# Altium project 16-07349-R5_SAM_L10_XPro.PrjPcb (part 2 of 3)

## Sheet SHT_4_MCU_07349-R5_L10.SchDoc
size B; CompanyName: Microchip Technology Inc.; Organization: Microchip Technology; Address1: 2355 West Chandler Blvd.; Address2: Chandler, AZ  85224; Address4: USA; SheetNumber: 4; SheetTotal: 9; SheetTitle: Target MCU; Time: Time
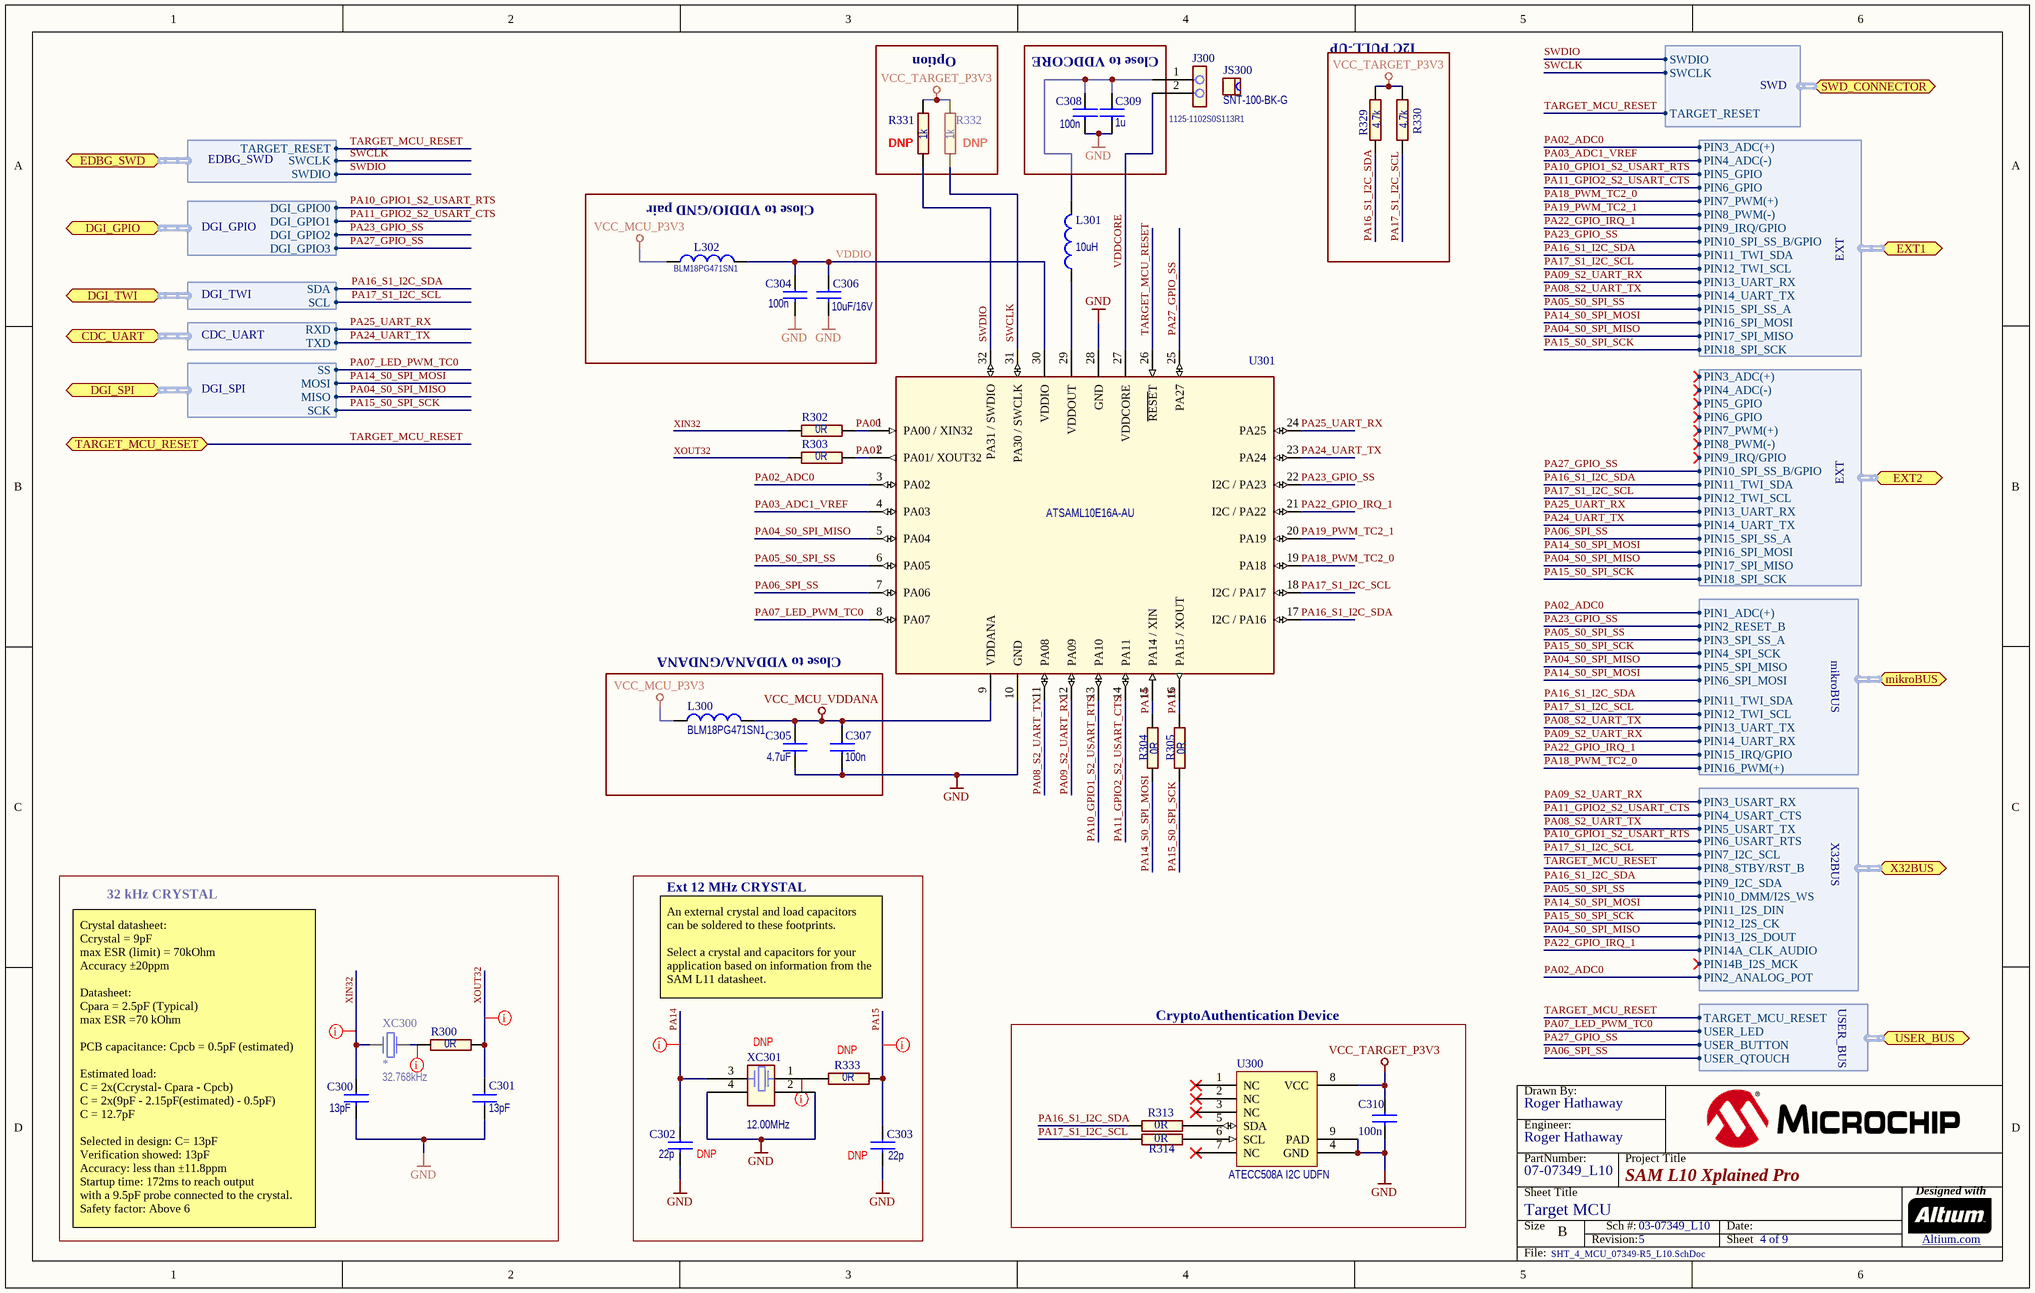
[diagram p5: SHT_4_MCU_07349-R5_L10.SchDoc]

### Parts
(Parts that share a designator on the sheet are numbered #1, #2 ... from top to bottom, then left to right.)
?#6  (no value)  (graphical)
C300  value 13pF  [AP1-00053]  (hidden comment: CAP-NONPOL)
C301  value 13pF  [AP1-00053]  (hidden comment: CAP-NONPOL)
C302  value 22p  Placement: DNP  [AP1-00001]  (hidden comment: CAP-NONPOL)
C303  value 22p  Placement: DNP  [AP1-00001]  (hidden comment: CAP-NONPOL)
C304  value 100n  [AP1-00001]  (hidden comment: CAP-NONPOL)
C305  value 4.7uF  [AP1-00039]  (hidden comment: CAP-NONPOL)
C306  value 10uF/16V  [AP1-00039]  (hidden comment: CAP-NONPOL)
C307  value 100n  [AP1-00001]  (hidden comment: CAP-NONPOL)
C308  value 100n  [AP1-00001]  (hidden comment: CAP-NONPOL)
C309  value 1u  [AP1-00001]  (hidden comment: CAP-NONPOL)
C310  value 100n  [AP1-00053]
J300  MPN: 1125-1102S0S113R1  [AP8-01074]  (hidden comment: HEADER 1x2)
JS300  value SNT-100-BK-G  [AP8-00525]  (hidden comment: To be used by request from ESCATEC)
L300  value BLM18PG471SN1  [AP3-00005]  (hidden comment: INDUCTOR)
L301  value 10uH  [AP3-00157]  (hidden comment: INDUCTOR)
L302  value BLM18PG471SN1  [AP3-00005]  (hidden comment: INDUCTOR)
R300  value 0R  [AP2-00000]
R302  value 0R  [AP2-00000]
R303  value 0R  [AP2-00000]
R304  value 0R  [AP2-00000]
R305  value 0R  [AP2-00000]
R313  value 0R  [AP2-00000]
R314  value 0R  [AP2-00000]
R329  value 4.7k  [AP2-00032]
R330  value 4.7k  [AP2-00032]
R331  value 1k  Placement: DNP  [AP2-00000]
R332  value 1k  Placement: DNP  [AP2-00000]
R333  value 0R  Placement: DNP  [AP2-00000]
U300  value ATECC508A I2C UDFN  [AP6-00409]
U301  ATSAML10E16A-AU  [AP6-00508]
XC300  *  value 32.768kHz  [AP7-00090]
XC301  value 12.00MHz  Placement: DNP  [AP7-00039]

### Blocks framed on the sheet
Option: R331 R332
Close to VDDCORE: C308 C309
I2C PULL-UP: R329 R330
Close to VDDIO/GND pair: C304 C306 L302
32 kHz CRYSTAL: C300 C301 R300 XC300
Ext 12 MHz CRYSTAL: C302 C303 R333 XC301
CryptoAuthentication Device: C310 R313 R314 U300

### Ports
CDC_UART (harness CDC_UART), DGI_GPIO (harness DGI_GPIO), DGI_SPI (harness DGI_SPI), DGI_TWI (harness DGI_TWI), EDBG_SWD (harness EDBG_SWD), EXT1 (harness EXT), EXT2 (harness EXT), mikroBUS (harness mikroBUS), SWD_CONNECTOR (harness SWD), TARGET_MCU_RESET (bidir), USER_BUS (harness USER_BUS), X32BUS (harness X32BUS)

### Harnesses
DGI_GPIO: DGI_GPIO0, DGI_GPIO1, DGI_GPIO2, DGI_GPIO3
DGI_SPI: MISO, MOSI, SCK, SS
DGI_TWI: SCL, SDA
CDC_UART: RXD, TXD
EXT: PIN10_SPI_SS_B/GPIO, PIN11_TWI_SDA, PIN12_TWI_SCL, PIN13_UART_RX, PIN14_UART_TX, PIN15_SPI_SS_A, PIN16_SPI_MOSI, PIN17_SPI_MISO, PIN18_SPI_SCK, PIN3_ADC(+), PIN4_ADC(-), PIN5_GPIO, PIN6_GPIO, PIN7_PWM(+), PIN8_PWM(-), PIN9_IRQ/GPIO
SWD: SWCLK, SWDIO, TARGET_RESET
EDBG_SWD: TARGET_RESET, SWCLK, SWDIO
mikroBUS: PIN1_ADC(+), PIN2_RESET_B, PIN3_SPI_SS_A, PIN4_SPI_SCK, PIN5_SPI_MISO, PIN6_SPI_MOSI, PIN11_TWI_SDA, PIN12_TWI_SCL, PIN13_UART_TX, PIN14_UART_RX, PIN15_IRQ/GPIO, PIN16_PWM(+)
X32BUS: PIN13_I2S_DOUT, PIN11_I2S_DIN, PIN9_I2C_SDA, PIN7_I2C_SCL, PIN5_USART_TX, PIN3_USART_RX, PIN4_USART_CTS, PIN6_USART_RTS, PIN8_STBY/RST_B, PIN10_DMM/I2S_WS, PIN12_I2S_CK, PIN14A_CLK_AUDIO, PIN14B_I2S_MCK, PIN2_ANALOG_POT
USER_BUS: USER_QTOUCH, USER_BUTTON, USER_LED, TARGET_MCU_RESET

### Nets
GND: C300.2 C301.2 C302.2 C303.2 C304.2 C305.2 C306.2 C307.2 C308.2 C309.2 C310.2 U300.4(GND) U300.9(PAD) U301.10(GND) U301.28(GND) XC301.2 XC301.4
VCC_MCU_P3V3: L300.1 L302.2
VCC_MCU_VDDANA: C305.1 C307.1 L300.2 U301.9(VDDANA)
VCC_TARGET_P3V3: C310.1 R329.1 R330.1 R331.1 R332.1 U300.8(VCC)
PA00: R302.2 U301.1(PA00_/_XIN32)
PA01: R303.2 U301.2(PA01/_XOUT32)
PA02_ADC0: U301.3(PA02) ; port EXT1.PIN3_ADC(+), port mikroBUS.PIN1_ADC(+), port X32BUS.PIN2_ANALOG_POT
PA03_ADC1_VREF: U301.4(PA03) ; port EXT1.PIN4_ADC(-)
PA04_S0_SPI_MISO: U301.5(PA04) ; port DGI_SPI.MISO, port EXT1.PIN17_SPI_MISO, port EXT2.PIN17_SPI_MISO, port mikroBUS.PIN5_SPI_MISO, port X32BUS.PIN13_I2S_DOUT
PA05_S0_SPI_SS: U301.6(PA05) ; port EXT1.PIN15_SPI_SS_A, port mikroBUS.PIN3_SPI_SS_A, port X32BUS.PIN10_DMM/I2S_WS
PA06_SPI_SS: U301.7(PA06) ; port EXT2.PIN15_SPI_SS_A, port USER_BUS.USER_QTOUCH
PA07_LED_PWM_TC0: U301.8(PA07) ; port DGI_SPI.SS, port USER_BUS.USER_LED
PA08_S2_UART_TX: U301.11(PA08) ; port EXT1.PIN14_UART_TX, port mikroBUS.PIN13_UART_TX, port X32BUS.PIN5_USART_TX
PA09_S2_UART_RX: U301.12(PA09) ; port EXT1.PIN13_UART_RX, port mikroBUS.PIN14_UART_RX, port X32BUS.PIN3_USART_RX
PA10_GPIO1_S2_USART_RTS: U301.13(PA10) ; port DGI_GPIO.DGI_GPIO0, port EXT1.PIN5_GPIO, port X32BUS.PIN6_USART_RTS
PA11_GPIO2_S2_USART_CTS: U301.14(PA11) ; port DGI_GPIO.DGI_GPIO1, port EXT1.PIN6_GPIO, port X32BUS.PIN4_USART_CTS
PA14: C302.1 R304.2 U301.15(PA14_/_XIN) XC301.3
PA14_S0_SPI_MOSI: R304.1 ; port DGI_SPI.MOSI, port EXT1.PIN16_SPI_MOSI, port EXT2.PIN16_SPI_MOSI, port mikroBUS.PIN6_SPI_MOSI, port X32BUS.PIN11_I2S_DIN
PA15: C303.1 R305.2 R333.1 U301.16(PA15_/_XOUT)
PA15_S0_SPI_SCK: R305.1 ; port DGI_SPI.SCK, port EXT1.PIN18_SPI_SCK, port EXT2.PIN18_SPI_SCK, port mikroBUS.PIN4_SPI_SCK, port X32BUS.PIN12_I2S_CK
PA16_S1_I2C_SDA: R313.2 R329.2 U301.17(I2C_/_PA16) ; port DGI_TWI.SDA, port EXT1.PIN11_TWI_SDA, port EXT2.PIN11_TWI_SDA, port mikroBUS.PIN11_TWI_SDA, port X32BUS.PIN9_I2C_SDA
PA17_S1_I2C_SCL: R314.2 R330.2 U301.18(I2C_/_PA17) ; port DGI_TWI.SCL, port EXT1.PIN12_TWI_SCL, port EXT2.PIN12_TWI_SCL, port mikroBUS.PIN12_TWI_SCL, port X32BUS.PIN7_I2C_SCL
PA18_PWM_TC2_0: U301.19(PA18) ; port EXT1.PIN7_PWM(+), port mikroBUS.PIN16_PWM(+)
PA19_PWM_TC2_1: U301.20(PA19) ; port EXT1.PIN8_PWM(-)
PA22_GPIO_IRQ_1: U301.21(I2C_/_PA22) ; port EXT1.PIN9_IRQ/GPIO, port mikroBUS.PIN15_IRQ/GPIO, port X32BUS.PIN14A_CLK_AUDIO
PA23_GPIO_SS: U301.22(I2C_/_PA23) ; port DGI_GPIO.DGI_GPIO2, port EXT1.PIN10_SPI_SS_B/GPIO, port mikroBUS.PIN2_RESET_B
PA24_UART_TX: U301.23(PA24) ; port CDC_UART.TXD, port EXT2.PIN14_UART_TX
PA25_UART_RX: U301.24(PA25) ; port CDC_UART.RXD, port EXT2.PIN13_UART_RX
PA27_GPIO_SS: U301.25(PA27) ; port DGI_GPIO.DGI_GPIO3, port EXT2.PIN10_SPI_SS_B/GPIO, port USER_BUS.USER_BUTTON
SWCLK: R332.2 U301.31(PA30_/_SWCLK) ; port SWD_CONNECTOR.SWCLK, port EDBG_SWD.SWCLK
SWDIO: R331.2 U301.32(PA31_/_SWDIO) ; port SWD_CONNECTOR.SWDIO, port EDBG_SWD.SWDIO
TARGET_MCU_RESET: U301.26(~{RESE}T) ; port TARGET_MCU_RESET, port SWD_CONNECTOR.TARGET_RESET, port EDBG_SWD.TARGET_RESET, port X32BUS.PIN8_STBY/RST_B, port USER_BUS.TARGET_MCU_RESET
VDDCORE: J300.2 U301.27(VDDCORE)
VDDIO: C304.1 C306.1 L302.1 U301.30(VDDIO)
XIN32: C300.1 R302.1 XC300.2
XOUT32: C301.1 R300.2 R303.1
NetC308_1: C308.1 C309.1 J300.1 L301.1
NetL301_2: L301.2 U301.29(VDDOUT)
NetR300_1: R300.1 XC300.1
NetR313_1: R313.1 U300.5(SDA)
NetR314_1: R314.1 U300.6(SCL)
NetR333_2: R333.2 XC301.1

Not connected (* = marked no-connect by the designer): U300 1(NC)* 2(NC)* 3(NC)* 7(NC)*

### Layout directives
rule Assembly Testpoint Usage [Testpoint - Not Allowed    Multiple - Not Allowed]: (no net found under the mark), NetR300_1, PA14, PA15, XIN32, XOUT32

### Notes on the sheet
- Close to VDDANA/GNDANA
- An external crystal and load capacitors can be soldered to these footprints.
  Select a crystal and capacitors for your application based on information from the SAM L11 datasheet.
- (near C300) Crystal datasheet:
  Ccrystal = 9pF
  max ESR (limit) = 70kOhm
  Accuracy ±20ppm
  Datasheet:
  Cpara = 2.5pF (Typical)
  max ESR =70 kOhm
  PCB capacitance: Cpcb = 0.5pF (estimated)
  Estimated load:
  C = 2x(Ccrystal- Cpara - Cpcb)
  C = 2x(9pF - 2.15pF(estimated) - 0.5pF)
  C = 12.7pF
  Selected in design: C= 13pF
  Verification showed: 13pF
  Accuracy: less than ±11.8ppm
  Startup time: 172ms to reach output
  with a 9.5pF probe connected to the crystal.
  Safety factor: Above 6
- Drawn By:
- Engineer:
- PartNumber:
- Project Title
- Sheet Title
- Size
- B
- Revision:
- Sch #:
- Date:
- Sheet
- Designed with
- Altium.com <http://go.altium.com/MicrochipLandingPage_Evaluation.html>
- File:

### Library data of the parts
?#6 = Title Block B
C300 C301 = A01-0793: Ceramic capacitor, SMD 0402, NP0, 50V, +/-5%; PartGroup: Capacitors,Ceramic,SMD 0402; Manufacturer: Murata; MPN: GRM1555C1H130JA01D; Tolerance: 5%; TemperatureRange: -55 - +125 deg C; ComponentStatus: 'Active (verified)'; Status: Active; Verified by: Lars Helge Mo; Verified date: 2005-12-15; AN: A01-0793; FootprintStatus: 'Active (Verified)'
C302 C303 = A01-0019: Ceramic capacitor, SMD 0402, NP0, 50V, +/-5%; PartGroup: Capacitors,Ceramic,SMD 0402; Manufacturer: YAGEO CORP; MPN: CC0402JRNPO9BN220; TemperatureRange: -55 - +125 deg C; ComponentStatus: 'Active (verified)'; Status: Active; Verified by: Lars Helge Mo; Verified date: 2005-12-15; AN: A01-0019; Tolerance: 50V, +/-5%; Height: 0.550000011920929; FootprintStatus: 'Active (Verified)'
C304 C307 C308 C310 = A01-0246: as C501 on sheet SHT_6_I_Measure_07349-R5_L10; Status: Active; Verified by: Lars Helge Mo; Verified date: 2005-12-15; AN: A01-0246; Tolerance: 16V, +/-10%; Height: 0.5; FootprintStatus: 'Active (Verified)'
C305 = A01-0377: Ceramic capacitor, SMD 0603, X5R, 10V, 10% (de31036); PartGroup: Capacitors,Ceramic,SMD 0603; Manufacturer: WALSIN Technology Corporation; MPN: 0603X475K100CT; TemperatureRange: -55 - +85 deg C; ComponentStatus: 'Active (verified)'; Status: Active; Verified by: Lars Helge Mo; Verified date: 2005-12-15; AN: A01-0377; Tolerance: 10%; Height: 0.800000011920929; FootprintStatus: 'Active (Verified)'
C306 = A01-0491: Ceramic capacitor, SMD 0603, X5R, 16V, 10UF ± 20% (High Density); PartGroup: Capacitors,Ceramic,SMD 0603; Manufacturer: Taiyo Yuden; MPN: EMK107BBJ106MA-T; Tolerance: ­± 20%; TemperatureRange: -55°C to +85°C; ComponentStatus: 'Active (verified)'; Status: Active; Verified by: Lars Helge Mo; Verified date: 2005-12-15; AN: A01-0491; Height: 0.819999992847443; FootprintStatus: 'Active (Verified)'
C309 = A01-0286: Ceramic capacitor, SMD 0402, X5R, 6.3V, +/-10% (de26942); PartGroup: Capacitors,Ceramic,SMD 0402; Manufacturer: Kemet; MPN: C0402C105K9PAC; TemperatureRange: -55 to 85 deg C; ComponentStatus: 'Active (verified)'; Status: Active; Verified by: Lars Helge Mo; Verified date: 2005-12-15; AN: A01-0286; Tolerance: +/-10%; Height: 0.5; FootprintStatus: 'Active (Verified)'
J300 = A08-2782: 1x2 pin header, 2.54mm pitch, Pin-in-Paste THM; PartGroup: Mechanical devices,Connectors,Pin headers; Manufacturer: WCON HARDWARE ELECTRONICS CO., LTD; Value: 1125-1102S0S113R1; TemperatureRange: -40Â°C to +105Â°C; ComponentStatus: 'Active (verified)'; Verified date: 2006-01-30; Verified by: Lars Helge; Status: Active; AN: A08-2782; Height: 9; FootprintStatus: 'Active (Verified)'
JS300 = A08-0543: Jumper cap for 2.54mm pinheader; PartGroup: Mechanical devices,Mounting accessories,Other; Manufacturer: SAMTEC; ComponentStatus: 'Active (verified)'; Verified date: 2006-04-05; Verified by: Lars Helge Mo; Status: Active; AN: A08-0543; MPN: SNT-100-BK-G; FootprintStatus: 'Active (Verified)'
L300 L302 = A03-0035: SMD RF inductor 0603. Z=470Ohm (@100MHz), Max R(dc)=0.20Ohm, Max current=1A; PartGroup: Inductors,EMI; Manufacturer: Murata; TemperatureRange: -55; ComponentStatus: 'Active (verified)'; Verified date: 2006-01-30; Verified by: Lars Helge Mo; Status: Active; AN: A03-0035; Height: 0.800000011920929; MPN: BLM18PG471SN1; FootprintStatus: 'Active (Verified)'
L301 = A03-0301: SMD power inductor, LxWxH=3.0x3.0x2.0mm, Isat=2.35A, Ir=1.2A, Rdc=0.28Ohm, 20%; PartGroup: Inductors,Power Inductors; Manufacturer: Wurth Elektronik; MPN: 74438336100; TemperatureRange: -40 to +125 deg C; ComponentStatus: 'Active (verified)'; Verified date: 2006-01-30; Verified by: Lars Helge Mo; Status: Active; AN: A03-0301; Tolerance: 20%; Height: 2; FootprintStatus: 'Active (Verified)'
R300 R302-R305 R313 R314 R333 = A02-0163: as R505 on sheet SHT_6_I_Measure_07349-R5_L10; Status: Active; Verified by: Lars Helge Mo; Verified date: 2005-12-19; AN: A02-0163; Height: 0.349999994039536; FootprintStatus: 'Active (Verified)'
R329 R330 = A02-0765: Thick film resistor, SMD 0402, 1/16W, 5%; PartGroup: Resistors,SMD,0402 5%; Manufacturer: (n/a); MPN: CR10-4701-FK; TemperatureRange: -55°C to +125°C; ComponentStatus: 'Active (verified)'; Status: Active; Verified by: Lars Helge Mo; Verified date: 2005-12-19; AN: A02-0765; Tolerance: 5%; Height: 0.349999994039536; FootprintStatus: 'Active (Verified)'
R331 R332 = A02-0212: Thick film resistor, SMD 0402, 1/16W, 1%; PartGroup: Resistors,SMD,0402 1%; Manufacturer: ASJ; MPN: CR10-1001-FK; TemperatureRange: -55 - +125 deg C; ComponentStatus: 'Active (verified)'; Status: Active; Verified by: Lars Helge Mo; Verified date: 2005-12-19; AN: A02-0212; Tolerance: 1 %; Height: 0.349999994039536; FootprintStatus: 'Active (Verified)'
U300 = A06-1281: ATECC508A with an I2C Interface and a 8 Pin UDFN Package with Paddle; PartGroup: Integrated Circuits,Special function,Encryption; Manufacturer: MICROCHIP; MPN: ATECC508A-MAHDA-T; ComponentStatus: 'Active (verified)'; Status: New; AN: A06-1281; Height: 0.600000023841858; FootprintStatus: 'Active (Verified)'
U301 = A06-1590: 32 Bit Ultra Low Power MCU w/ 64K Flash; PartGroup: Integrated Circuits,MCU, MPU, DSP,ARM MCU; Manufacturer: Microchip; ComponentStatus: 'Active (verified)'; Status: New; Verified by: *; Verified date: *; Design comments: *; AN: A06-1590; Value: ATSAML10E16A-AU; Height: 1; MPN: ATSAML10E16A-AU; FootprintStatus: 'Active (Verified)'
XC300 = A07-0129: Kyocera ST3215SB32768E0HPWBB, 32.768kHz, 9pF, SMD tuning fork crystal; PartGroup: Frequency devices,Crystals,SMD; Manufacturer: Kyocera Crystal Device Corporation; Tolerance: Â±20ppm; TemperatureRange: -40Â°C to +85Â°C; ComponentStatus: 'Active (verified)'; AN: A07-0129; Height: 0.800000011920929; MPN: ST3215SB32768E0HPWBB; FootprintStatus: 'Active (Verified)'; Status: Active; Verified by: Sveinung Helgeland; Verified date: 2006-02-17
XC301 = A07-0042: Fox FQ5032B 12.0000MHz  20pF SMD crystal 738B-12; PartGroup: Frequency devices,Crystals,SMD; Manufacturer: Fox  Electronics; MPN: FQ5032B-12.000; Tolerance: Â±30ppm; TemperatureRange: 0Â°C ~ 70Â°C; ComponentStatus: 'Active (verified)'; Status: Active; Verified by: Ketil Skjerve; Verified date: 2007-06-15; AN: A07-0042; Height: 1.20000004768372; FootprintStatus: 'Active (Verified)'

## Sheet SHT_3_EDBG_07349-R5_L10.SchDoc
size B; CompanyName: Microchip Technology Inc.; Organization: Microchip Technology; Address1: 2355 West Chandler Blvd.; Address2: Chandler, AZ  85224; Address4: USA; SheetNumber: 3; SheetTotal: 9; SheetTitle: Embedded Debugger (EDBG); Time: Time
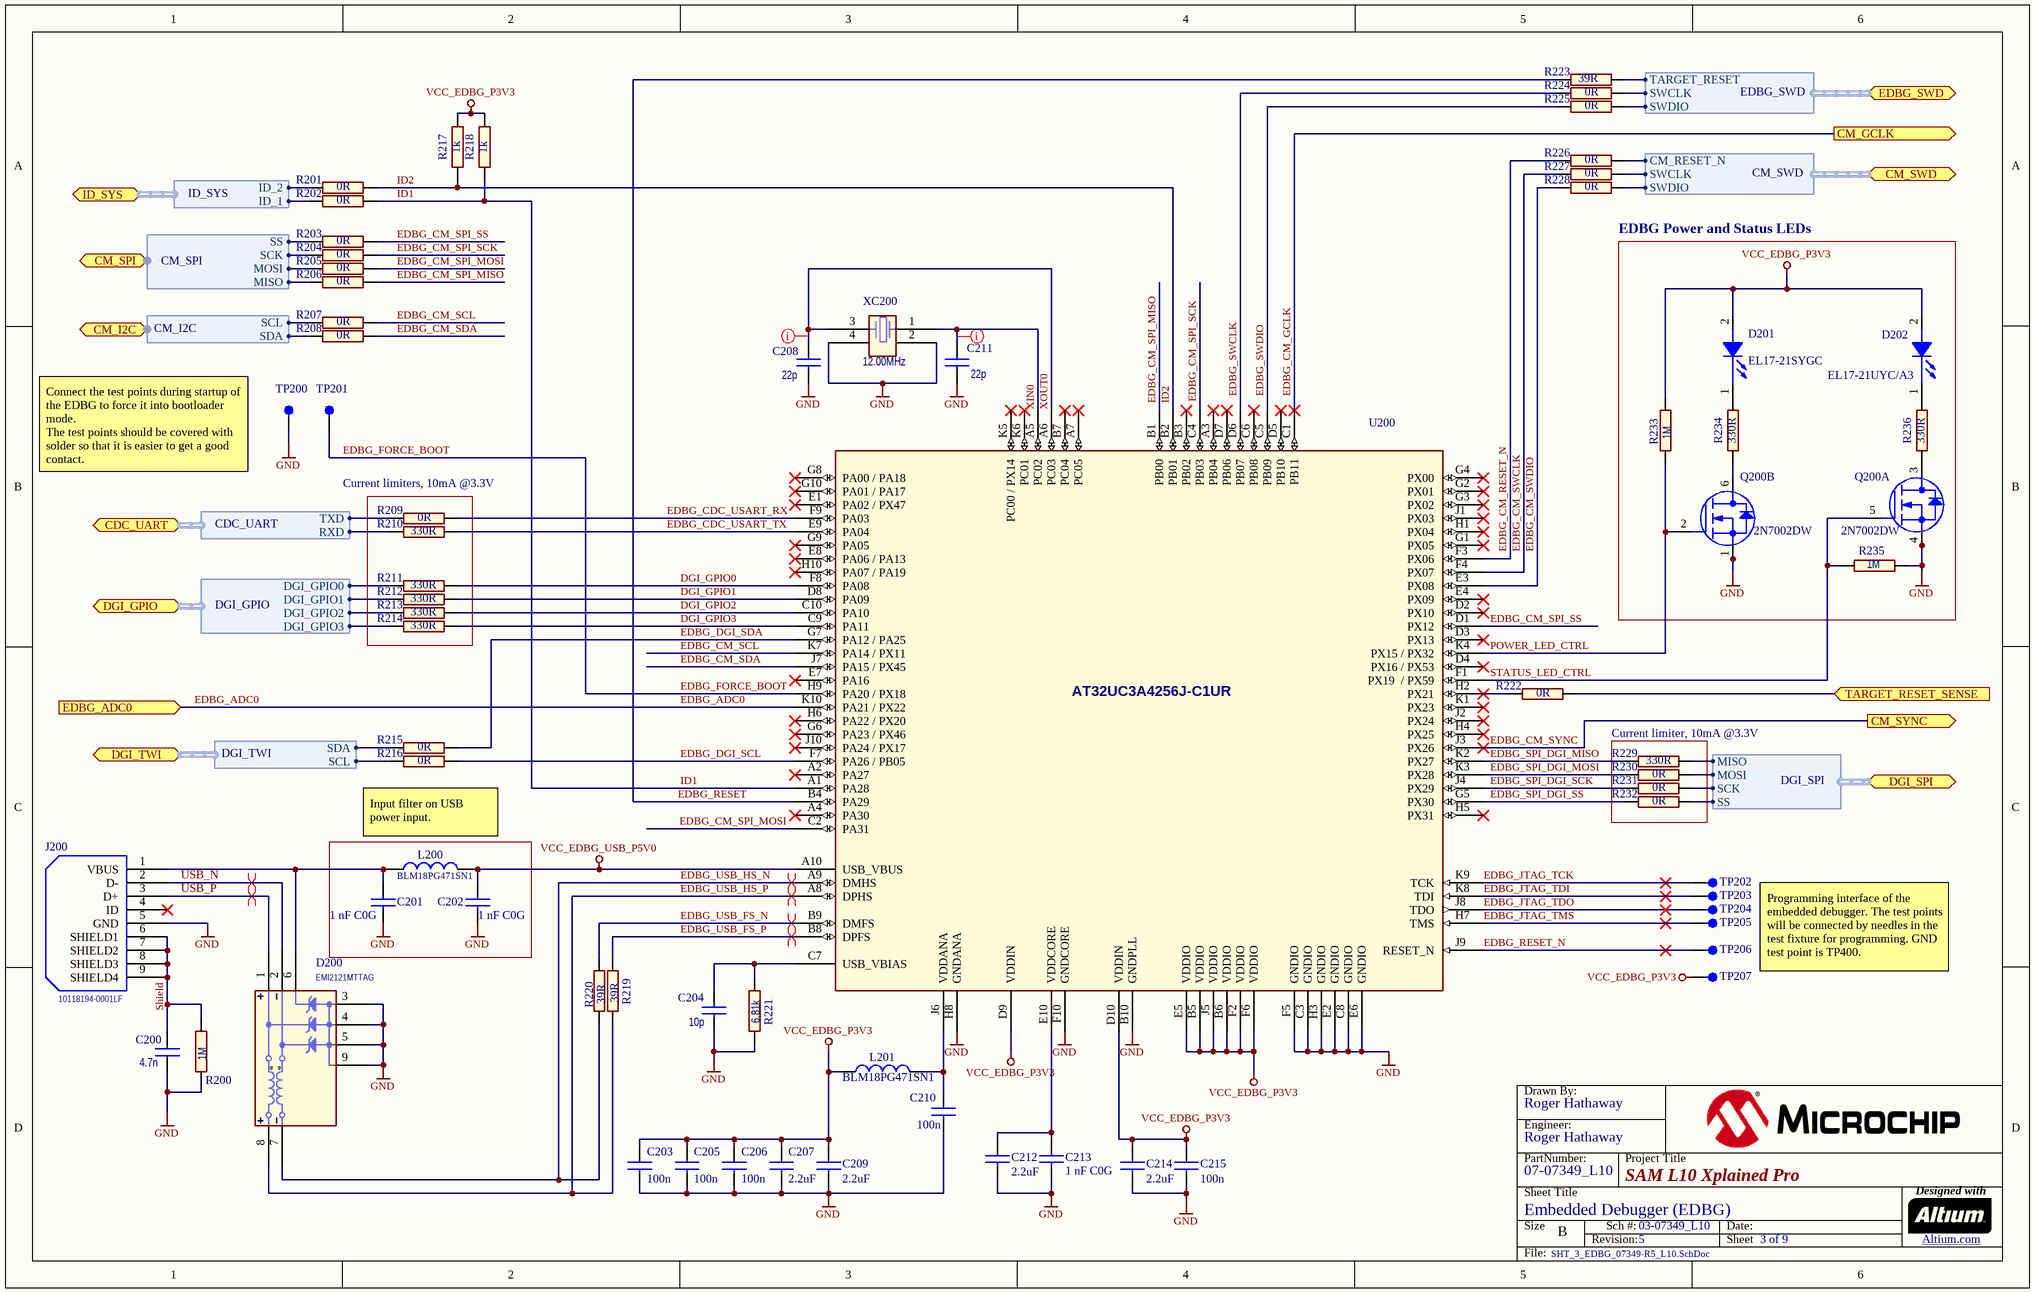
[diagram p6: SHT_3_EDBG_07349-R5_L10.SchDoc]

### Parts
(Parts that share a designator on the sheet are numbered #1, #2 ... from top to bottom, then left to right.)
?#7  (no value)  (graphical)
C200  value 4.7n  [AP1-00053]
C201  value 1 nF C0G  [AP1-00053]
C202  value 1 nF C0G  [AP1-00053]
C203  value 100n  [AP1-00053]
C204  value 10p  [AP1-00053]
C205  value 100n  [AP1-00053]
C206  value 100n  [AP1-00053]
C207  value 2.2uF  [AP1-00053]  (hidden comment: Farnell no: 1288200)
C208  value 22p  [AP1-00053]
C209  value 2.2uF  [AP1-00053]  (hidden comment: Farnell no: 1288200)
C210  value 100n  [AP1-00053]
C211  value 22p  [AP1-00053]
C212  value 2.2uF  [AP1-00053]  (hidden comment: Farnell no: 1288200)
C213  value 1 nF C0G  [AP1-00053]
C214  value 2.2uF  [AP1-00053]
C215  value 100n  [AP1-00053]  (hidden comment: Farnell no: 1288200)
D200  value EMI2121MTTAG  [AP4-00159]  (hidden comment: WDFN8)
D201  value EL17-21SYGC  [AP4-00013]
D202  value EL17-21UYC/A3  [AP4-00013]
J200  MPN: 10118194-0001LF  [AP8-01117]  (hidden comment: USB_AB)
L200  value BLM18PG471SN1  [AP3-00005]
L201  value BLM18PG471SN1  [AP3-00005]
Q200  value 2N7002DW  [AP5-00001]  (hidden comment: Same as 2N7002 but with two MOSFETs in one package)  (parts A,B of 2)
R200  value 1M  [AP2-00011]
R201  value 0R  [AP2-00011]
R202  value 0R  [AP2-00011]
R203  value 0R  [AP2-00011]
R204  value 0R  [AP2-00011]
R205  value 0R  [AP2-00011]
R206  value 0R  [AP2-00011]
R207  value 0R  [AP2-00011]
R208  value 0R  [AP2-00011]
R209  value 0R  [AP2-00000]
R210  value 330R  [AP2-00000]
R211  value 330R  [AP2-00000]
R212  value 330R  [AP2-00000]
R213  value 330R  [AP2-00000]
R214  value 330R  [AP2-00000]
R215  value 0R  [AP2-00000]
R216  value 0R  [AP2-00000]
R217  value 1k  [AP2-00000]
R218  value 1k  [AP2-00000]
R219  value 39R  [AP2-00011]
R220  value 39R  [AP2-00011]
R221  value 6.81k  [AP2-00011]
R222  value 0R  [AP2-00000]
R223  value 39R  [AP2-00011]
R224  value 0R  [AP2-00011]
R225  value 0R  [AP2-00011]
R226  value 0R  [AP2-00000]
R227  value 0R  [AP2-00000]
R228  value 0R  [AP2-00000]
R229  value 330R  [AP2-00000]
R230  value 0R  [AP2-00000]
R231  value 0R  [AP2-00000]
R232  value 0R  [AP2-00000]
R233  value 1M  [AP2-00011]
R234  value 330R  [AP2-00011]
R235  value 1M  [AP2-00011]
R236  value 330R  [AP2-00011]
TP200  (no value)  [AP8-00010]  (no BOM)
TP201  (no value)  [AP8-00010]  (no BOM)
TP202  (no value)  [AP8-00010]  (no BOM)
TP203  (no value)  [AP8-00010]  (no BOM)
TP204  (no value)  [AP8-00010]  (no BOM)
TP205  (no value)  [AP8-00010]  (no BOM)
TP206  (no value)  [AP8-00010]  (no BOM)
TP207  (no value)  [AP8-00010]  (no BOM)
U200  value AT32UC3A4256J-C1UR  [AP6-00206]  (hidden comment: 100 ball VFBGA)
XC200  value 12.00MHz  [AP7-00039]

### Blocks framed on the sheet
EDBG Power and Status LEDs: D201 D202 Q200 R233-R236
Current limiter, 10mA @3.3V: R229-R232

### Ports
CDC_UART (harness CDC_UART), CM_GCLK (out), CM_I2C (harness CM_I2C), CM_SPI (harness CM_SPI), CM_SWD (harness CM_SWD), CM_SYNC (out), DGI_GPIO (harness DGI_GPIO), DGI_SPI (harness DGI_SPI), DGI_TWI (harness DGI_TWI), EDBG_ADC0 (in), EDBG_SWD (harness EDBG_SWD), ID_SYS (harness ID_SYS), TARGET_RESET_SENSE (in)

### Harnesses
CDC_UART: TXD, RXD
DGI_SPI: MISO, MOSI, SCK, SS
DGI_GPIO: DGI_GPIO0, DGI_GPIO1, DGI_GPIO2, DGI_GPIO3
ID_SYS: ID_1, ID_2
DGI_TWI: SCL, SDA
CM_I2C: SCL, SDA
CM_SWD: SWCLK, SWDIO, CM_RESET_N
CM_SPI: MISO, MOSI, SCK, SS
EDBG_SWD: SWCLK, SWDIO, TARGET_RESET

### Nets
GND: C200.1 C201.2 C202.2 C203.2 C204.2 C205.2 C206.2 C207.2 C208.2 C209.2 C210.2 C211.2 C212.2 C213.2 C214.2 C215.2 D200.3(GND) D200.4(GND) D200.5(GND) D200.9(GND) J200.5(GND) Q200.1(S2) Q200.4(S1) R200.1 R221.1 R235.1 TP200.1 U200.B10(GNDPLL) U200.C3(GNDIO) U200.C8(GNDIO) U200.E2(GNDIO) U200.E6(GNDIO) U200.F5(GNDIO) U200.F10(GNDCORE) U200.H3(GNDIO) U200.H8(GNDANA) XC200.2 XC200.4
VCC_EDBG_P3V3: C203.1 C205.1 C206.1 C207.1 C209.1 C214.1 C215.1 D201.2(ANODE) D202.2(ANODE) L201.1 R217.2 R218.2 R233.2 TP207.1 U200.B5(VDDIO) U200.B6(VDDIO) U200.D9(VDDIN) U200.D10(VDDIN) U200.E5(VDDIO) U200.F2(VDDIO) U200.F6(VDDIO) U200.J5(VDDIO)
VCC_EDBG_USB_P5V0: C202.1 L200.2 U200.A10(USB_VBUS)
CM_PA16_SERCOM1_SDA: R208.2 ; port CM_I2C.SDA
CM_PA17_SERCOM1_SCL: R207.2 ; port CM_I2C.SCL
CM_PA22_SERCOM3_PAD0_SPI_MOSI: R205.2 ; port CM_SPI.MOSI
CM_PA23_SERCOM3_PAD1_SPI_SCK: R204.2 ; port CM_SPI.SCK
CM_PA24_SERCOM3_PAD2_SPI_MISO: R206.2 ; port CM_SPI.MISO
CM_PA25_SPI_SS: R203.2 ; port CM_SPI.SS
CM_PA30_SWCLK: R227.1 ; port CM_SWD.SWCLK
CM_PA31_SWDIO: R228.1 ; port CM_SWD.SWDIO
CM_RESET_N: R226.1 ; port CM_SWD.CM_RESET_N
DGI_GPIO0: R211.2 U200.F8(PA08)
DGI_GPIO1: R212.2 U200.D8(PA09)
DGI_GPIO2: R213.2 U200.C10(PA10)
DGI_GPIO3: R214.2 U200.C9(PA11)
EDBG_ADC0: U200.K10(PA21_/_PX22) ; port EDBG_ADC0  [project net CM_PA09_AIN17]
EDBG_CDC_USART_RX: R209.1 U200.F9(PA03)
EDBG_CDC_USART_TX: R210.2 U200.E9(PA04)
EDBG_CM_GCLK: U200.C1(PB11) ; port CM_GCLK  [project net CM_PA14_GCLK0]
EDBG_CM_RESET_N: R226.2 U200.F3(PX06)
EDBG_CM_SCL: R207.1 U200.K7(PA14_/_PX11)
EDBG_CM_SDA: R208.1 U200.J7(PA15_/_PX45)
EDBG_CM_SPI_MISO: R206.1 U200.B1(PB00)
EDBG_CM_SPI_MOSI: R205.1 U200.C2(PA31)
EDBG_CM_SPI_SCK: R204.1 U200.C4(PB03)
EDBG_CM_SPI_SS: R203.1 U200.D1(PX12)
EDBG_CM_SWCLK: R227.2 U200.F4(PX07)
EDBG_CM_SWDIO: R228.2 U200.E3(PX08)
EDBG_CM_SYNC: U200.J3(PX26) ; port CM_SYNC  [project net CM_PA11_GCLK5]
EDBG_DGI_SCL: R216.1 U200.F7(PA26_/_PB05)
EDBG_DGI_SDA: R215.1 U200.G7(PA12_/_PA25)
EDBG_FORCE_BOOT: TP201.1 U200.H9(PA20_/_PX18)
EDBG_JTAG_TCK: TP202.1 U200.K9(TCK)
EDBG_JTAG_TDI: TP203.1 U200.K8(TDI)
EDBG_JTAG_TDO: TP204.1 U200.J8(TDO)
EDBG_JTAG_TMS: TP205.1 U200.H7(TMS)
EDBG_RESET: R223.1 U200.B4(PA29)
EDBG_RESET_N: TP206.1 U200.J9(RESET_N)
EDBG_SPI_DGI_MISO: R229.1 U200.K2(PX27)
EDBG_SPI_DGI_MOSI: R230.2 U200.K3(PX28)
EDBG_SPI_DGI_SCK: R231.2 U200.J4(PX29)
EDBG_SPI_DGI_SS: R232.2 U200.G5(PX30)
EDBG_SWCLK: R224.2 U200.D6(PB07)
EDBG_SWDIO: R225.1 U200.C5(PB09)
EDBG_USB_FS_N: R220.2 U200.B9(DMFS)
EDBG_USB_FS_P: R219.2 U200.B8(DPFS)
EDBG_USB_HS_N: D200.7(DIFF2_INT) R220.1 U200.A9(DMHS)
EDBG_USB_HS_P: D200.8(DIFF1_INT) R219.1 U200.A8(DPHS)
ID1: R202.1 R218.1 U200.A1(PA28)
ID2: R201.1 R217.1 U200.B2(PB01)
PA04_S0_SPI_MISO: R229.2 ; port DGI_SPI.MISO
PA07_LED_PWM_TC0: R232.1 ; port DGI_SPI.SS
PA10_GPIO1_S2_USART_RTS: R211.1 ; port DGI_GPIO.DGI_GPIO0
PA11_GPIO2_S2_USART_CTS: R212.1 ; port DGI_GPIO.DGI_GPIO1
PA14_S0_SPI_MOSI: R230.1 ; port DGI_SPI.MOSI
PA15_S0_SPI_SCK: R231.1 ; port DGI_SPI.SCK
PA16_S1_I2C_SDA: R215.2 ; port DGI_TWI.SDA
PA17_S1_I2C_SCL: R216.2 ; port DGI_TWI.SCL
PA23_GPIO_SS: R213.1 ; port DGI_GPIO.DGI_GPIO2
PA24_UART_TX: R209.2 ; port CDC_UART.TXD
PA25_UART_RX: R210.1 ; port CDC_UART.RXD
PA27_GPIO_SS: R214.1 ; port DGI_GPIO.DGI_GPIO3
POWER_LED_CTRL: Q200.2(G2) R233.1 U200.K4(PX15_/_PX32)
Shield: C200.2 J200.6(SHIELD1) J200.7(SHIELD2) J200.8(SHIELD3) J200.9(SHIELD4) R200.2
STATUS_LED_CTRL: Q200.5(G1) R235.2 U200.F1(PX19__/_PX59)
SWCLK: R224.1 ; port EDBG_SWD.SWCLK
SWDIO: R225.2 ; port EDBG_SWD.SWDIO
TARGET_MCU_RESET: R222.1 R223.2 ; port TARGET_RESET_SENSE, port EDBG_SWD.TARGET_RESET
USB_N: D200.2(DIFF2_EXT) J200.2(D-)
USB_P: D200.1(DIFF1_EXT) J200.3(D+)
XIN0: C211.1 U200.A5(PC02) XC200.1
XOUT0: C208.1 U200.A6(PC03) XC200.3
NetC201_1: C201.1 D200.6(VBUS) J200.1(VBUS) L200.1
NetC204_1: C204.1 R221.2 U200.C7(USB_VBIAS)
NetC210_1: C210.1 L201.2 U200.J6(VDDANA)
NetC212_1: C212.1 C213.1 U200.E10(VDDCORE)
NetD201_1: D201.1(CATHODE) R234.2
NetD202_1: D202.1(CATHODE) R236.2
NetJ700_1: R202.2 ; port ID_SYS.ID_1
NetJ701_1: R201.2 ; port ID_SYS.ID_2
NetQ200_3: Q200.3(D1) R236.1
NetQ200_6: Q200.6(D2) R234.1
NetR222_2: R222.2 U200.H2(PX21)

Not connected (* = marked no-connect by the designer): J200 4(ID)*; U200 A2(PA27)* A3(PB04)* A4(PA30)* A7(PC05)* B3(PB02)* B7(PC04)* C6(PB08)* D2(PX10)* D3(PX13)* D4(PX16_/_PX53)* D5(PB10)* D7(PB06)* E1(PA02_/_PX47)* E4(PX09)* E7(PA16)* E8(PA06_/_PA13)* G1(PX05)* G2(PX01)* G3(PX02)* G4(PX00)* G6(PA23_/_PX46)* G8(PA00_/_PA18)* G9(PA05)* G10(PA01_/_PA17)* H1(PX04)* H4(PX25)* H5(PX31)* H6(PA22_/_PX20)* H10(PA07_/_PA19)* J1(PX03)* J2(PX24)* J10(PA24_/_PX17)* K1(PX23)* K5(PC00_/_PX14)* K6(PC01)*

### Layout directives
differential pair; rule Assembly Testpoint Usage [Testpoint - Not Allowed    Multiple - Not Allowed]: EDBG_USB_FS_N, EDBG_USB_FS_P, EDBG_USB_HS_N, EDBG_USB_HS_P, USB_N, USB_P
rule Assembly Testpoint Usage [Testpoint - Not Allowed    Multiple - Not Allowed]: XIN0, XOUT0

### Notes on the sheet
- (near TP200) Connect the test points during startup of the EDBG to force it into bootloader mode.
  The test points should be covered with solder so that it is easier to get a good contact.
- Current limiters, 10mA @3.3V
- Input filter on USB power input.
- Programming interface of the embedded debugger. The test points will be connected by needles in the test fixture for programming. GND test point is TP400.
- Drawn By:
- Engineer:
- PartNumber:
- Project Title
- Sheet Title
- Size
- B
- Revision:
- Sch #:
- Date:
- Sheet
- Designed with
- Altium.com <http://go.altium.com/MicrochipLandingPage_Evaluation.html>
- File:

### Library data of the parts
?#7 = Title Block B
C200 = A01-0046: Ceramic capacitor, SMD 0402, X7R, 25V, +/-10% (de35287); PartGroup: Capacitors,Ceramic,SMD 0402; Manufacturer: PHYCOMP; MPN: 2238 587 15632; TemperatureRange: -55 - +125 deg C; ComponentStatus: 'Active (verified)'; Status: Active; Verified by: Lars Helge Mo; Verified date: 2005-12-15; AN: A01-0046; Tolerance: 25V, +/-10%; Height: 0.550000011920929; FootprintStatus: 'Active (Verified)'
C201 C202 C213 = A01-0321: Ceramic capacitor, SMD 0402, C0G, 50V, +/-5%; PartGroup: Capacitors,Ceramic,SMD 0402; Manufacturer: Murata; MPN: GRM1555C1H102JA01D; Tolerance: 5%; ComponentStatus: 'Active (verified)'; Status: Active; Verified by: Lars Helge Mo; Verified date: 2005-12-15; AN: A01-0321; FootprintStatus: 'Active (Verified)'; Height: 0.550000011920929
C203 C205 C206 C210 C215 = A01-0246: Ceramic capacitor, SMD 0402, X7R, 16V, +/-10%; PartGroup: Capacitors,Ceramic,SMD 0402; Manufacturer: Kemet; MPN: C0402C104K4RACTU; TemperatureRange: -55 - +125 deg C; ComponentStatus: 'Active (verified)'; Status: Active; Verified by: Lars Helge Mo; Verified date: 2005-12-15; AN: A01-0246; Tolerance: 16V, +/-10%; Height: 0.5; FootprintStatus: 'Active (Verified)'
C204 = A01-0015: Ceramic capacitor, SMD 0402, NP0, 50V, +/-5%; PartGroup: Capacitors,Ceramic,SMD 0402; Manufacturer: AVX; MPN: 04025A100JAT2A; TemperatureRange: -55 - +125 deg C; ComponentStatus: 'Active (verified)'; Status: Active; Verified by: Lars Helge Mo; Verified date: 2005-12-15; AN: A01-0015; Tolerance: 50V, +/-5%; Height: 0.550000011920929; FootprintStatus: 'Active (Verified)'
C207 C209 C212 C214 = A01-0300: Ceramic capacitor, SMD 0402, X5R, 6.3V, +/-20%; PartGroup: Capacitors,Ceramic,SMD 0402; Manufacturer: Kemet; MPN: C0402C225M9PAC; Tolerance: Â±20%; TemperatureRange: -55Â°C to +85Â°C; ComponentStatus: 'Active (verified)'; Status: Active; Verified by: Lars Helge Mo; Verified date: 2005-12-15; AN: A01-0300; Height: 0.5; FootprintStatus: 'Active (Verified)'
C208 C211 = A01-0019: Ceramic capacitor, SMD 0402, NP0, 50V, +/-5%; PartGroup: Capacitors,Ceramic,SMD 0402; Manufacturer: YAGEO CORP; MPN: CC0402JRNPO9BN220; TemperatureRange: -55 - +125 deg C; ComponentStatus: 'Active (verified)'; Status: Active; Verified by: Lars Helge Mo; Verified date: 2005-12-15; AN: A01-0019; Tolerance: 50V, +/-5%; Height: 0.550000011920929; FootprintStatus: 'Active (Verified)'
D200 = A04-0195: EMI2121, SZEMI2121 Single Pair Common Mode Filter with ESD Protection; PartGroup: Diodes,Transient suppression; Manufacturer: ON Semiconductor; TemperatureRange: âˆ’40 to +85 Â°C; ComponentStatus: 'Active (verified)'; AN: A04-0195; Height: 0.800000011920929; MPN: EMI2121MTTAG; FootprintStatus: 'Active (Verified)'
D201 = A10-0018: LED, Green, Wave length=575nm, SMD 0805, ±70°; PartGroup: Opto,LEDs,SMD; Manufacturer: Everlight; TemperatureRange: -40 - +85 deg C; ComponentStatus: 'Active (verified)'; Verified date: 2006-02-17; Verified by: Sveinung Helgeland; Status: Active; AN: A10-0018; Height: 1.10000002384186; MPN: EL17-21SYGC; FootprintStatus: 'Active (Verified)'
D202 = A10-0019: LED, Yellow, Wave length=591nm, SMD 0805, ±70°; PartGroup: Opto,LEDs,SMD; Manufacturer: Everlight; MPN: 17-21UYC/S530-A3/TR8; TemperatureRange: -40 to +85 deg C; ComponentStatus: 'Active (verified)'; Verified date: 2006-02-17; Verified by: Sveinung Helgeland; Status: Active; AN: A10-0019; Height: 1.10000002384186; FootprintStatus: 'Active (Verified)'
J200 = A08-2885: micro B USB 2.0 Receptacle Connector 5 Position Surface Mount, Right Angle; Through Hole; PartGroup: Mechanical devices,Connectors,USB; Manufacturer: Amphenol; Value: CONN USB MICRO B RECPT SMT R/A; ComponentStatus: 'Active (verified)'; Verified date: 2006-05-18; Verified by: Eirik Rasmussen; Status: Active; AN: A08-2885; Height: 2.40000009536743; FootprintStatus: 'Active (Verified)'
L200 L201 = A03-0035: SMD RF inductor 0603. Z=470Ohm (@100MHz), Max R(dc)=0.65Ohm, Max current=1A; PartGroup: Inductors,EMI; Manufacturer: Murata; Tolerance: ±25%; TemperatureRange: -55°C to +125°C; ComponentStatus: 'Active (verified)'; Verified date: 2006-01-30; Verified by: Lars Helge Mo; Status: Active; AN: A03-0035; Height: 0.800000011920929; MPN: BLM18PG471SN1; FootprintStatus: 'Active (Verified)'
Q200 = A05-0051: Dual N-Channel MOSFET, 60V, 115mA cont,RDS(ON) < 7.5 Ohm @50mA@5V, SOT-363; PartGroup: Transistors,Small signal FET,SMD; Manufacturer: Fairchild; TemperatureRange: -65 to 150 deg C; ComponentStatus: 'Active (verified)'; Status: New; AN: A05-0051; Height: 1.10000002384186; MPN: 2N7002DW; FootprintStatus: 'Active (Verified)'
R200 = A02-0846: Thick film resistror, SMD 0402, 1/16W, 1%; PartGroup: Resistors,SMD,0402 1%; Manufacturer: YAGEO CORP; MPN: RC0402FR-071ML; TemperatureRange: -55 to +155 deg C; ComponentStatus: 'Active (verified)'; Status: Active; Verified by: Lars Helge Mo; Verified date: 2005-12-19; AN: A02-0846; Tolerance: 1%; Height: 0.349999994039536; FootprintStatus: 'Active (Verified)'
R201-R209 R215 R216 R222 R224-R228 R230-R232 = A02-0163: RES 0.0 OHM 1/16W 0402 SMD; PartGroup: Resistors,SMD,0402 1%; Manufacturer: (n/a); MPN: RMCF0402ZT0R00; Tolerance: 1 %; TemperatureRange: -55 - +125 deg C; ComponentStatus: 'Active (verified)'; Status: Active; Verified by: Lars Helge Mo; Verified date: 2005-12-19; AN: A02-0163; Height: 0.349999994039536; FootprintStatus: 'Active (Verified)'
R210-R214 R229 R234 R236 = A02-0200: Thick film resistor, SMD 0402, 1/16W, 1%; PartGroup: Resistors,SMD,0402 1%; Manufacturer: ASJ; MPN: CR10-3300-FK; TemperatureRange: -55 - +125 deg C; ComponentStatus: 'Active (verified)'; Status: Active; Verified by: Lars Helge Mo; Verified date: 2005-12-19; AN: A02-0200; Tolerance: 1 %; Height: 0.349999994039536; FootprintStatus: 'Active (Verified)'
R217 R218 = A02-0212: Thick film resistor, SMD 0402, 1/16W, 1%; PartGroup: Resistors,SMD,0402 1%; Manufacturer: ASJ; MPN: CR10-1001-FK; TemperatureRange: -55 - +125 deg C; ComponentStatus: 'Active (verified)'; Status: Active; Verified by: Lars Helge Mo; Verified date: 2005-12-19; AN: A02-0212; Tolerance: 1 %; Height: 0.349999994039536; FootprintStatus: 'Active (Verified)'
R219 R220 R223 = A02-0178: Thick film resistor, SMD 0402, 1/16W, 1%; PartGroup: Resistors,SMD,0402 1%; Manufacturer: ASJ; MPN: CR10-39R0-FK; TemperatureRange: -55 - +125 deg C; ComponentStatus: 'Active (verified)'; Status: Active; Verified by: Lars Helge Mo; Verified date: 2005-12-19; AN: A02-0178; Tolerance: 1 %; Height: 0.349999994039536; FootprintStatus: 'Active (Verified)'
R221 = A02-0539: Thick film resistor, SMD 0402, 1/16W, 1%; PartGroup: Resistors,SMD,0402 1%; Manufacturer: vishay; MPN: CRCW04026K81FKED; TemperatureRange: -55 - +125 deg C; ComponentStatus: 'Active (verified)'; Status: Active; Verified by: Lars Helge Mo; Verified date: 2005-12-19; AN: A02-0539; Tolerance: 1%; Height: 0.349999994039536; FootprintStatus: 'Active (Verified)'
R233 R235 = A02-0846: Thick film resistror, SMD 0402, 1/16W, 1%; PartGroup: Resistors,SMD,0402 1%; Manufacturer: YAGEO CORP; MPN: RC0402FR-071ML; TemperatureRange: -55 to +155 deg C; ComponentStatus: 'Active (verified)'; Placement: YES; Status: Active; Verified by: Lars Helge Mo; Verified date: 2005-12-19; AN: A02-0846; Tolerance: 1%; Height: 0.349999994039536; FootprintStatus: 'Active (Verified)'
TP200-TP207 = A08-0004: Single SMD testpad; PartGroup: Mechanical devices,Connectors,Test points; ComponentStatus: 'Active (verified)'; Status: Active; Verified by: Sveinung Helgeland; Verified date: 2006-02-17; AN: A08-0004; Value: TESTPAD; Height: 0; FootprintStatus: 'Active (Verified)'
U200 = A06-0736: EDBG controller; PartGroup: Integrated Circuits,MCU, MPU, DSP,AVR MCU; Manufacturer: ATMEL; TemperatureRange: -40 to +85 deg C; ComponentStatus: 'Active (verified)'; Status: Not verified; AN: A06-0736; Height: 1; MPN: AT32UC3A4256J-C1UR; FootprintStatus: 'Active (Verified)'
XC200 = A07-0042: Fox FQ5032B 12.0000MHz  20pF SMD crystal 738B-12; PartGroup: Frequency devices,Crystals,SMD; Manufacturer: Fox  Electronics; MPN: FQ5032B-12.000; Tolerance: Â±30ppm; TemperatureRange: 0Â°C ~ 70Â°C; ComponentStatus: 'Active (verified)'; Status: Active; Verified by: Ketil Skjerve; Verified date: 2007-06-15; AN: A07-0042; Height: 1.20000004768372; FootprintStatus: 'Active (Verified)'

## Sheet SHT_2_Power_07349-R5_L10.SchDoc
size B; CompanyName: Microchip Technology Inc.; DrawnBy: Roger Hathaway; Organization: Microchip Technology; Address1: 2355 West Chandler Blvd.; Address2: Chandler, AZ  85224; Address4: USA; SheetNumber: 2; SheetTotal: 9; SheetTitle: Input Source Select and Power Supplies; Time: Time; ProjectName: OMEGA - L10
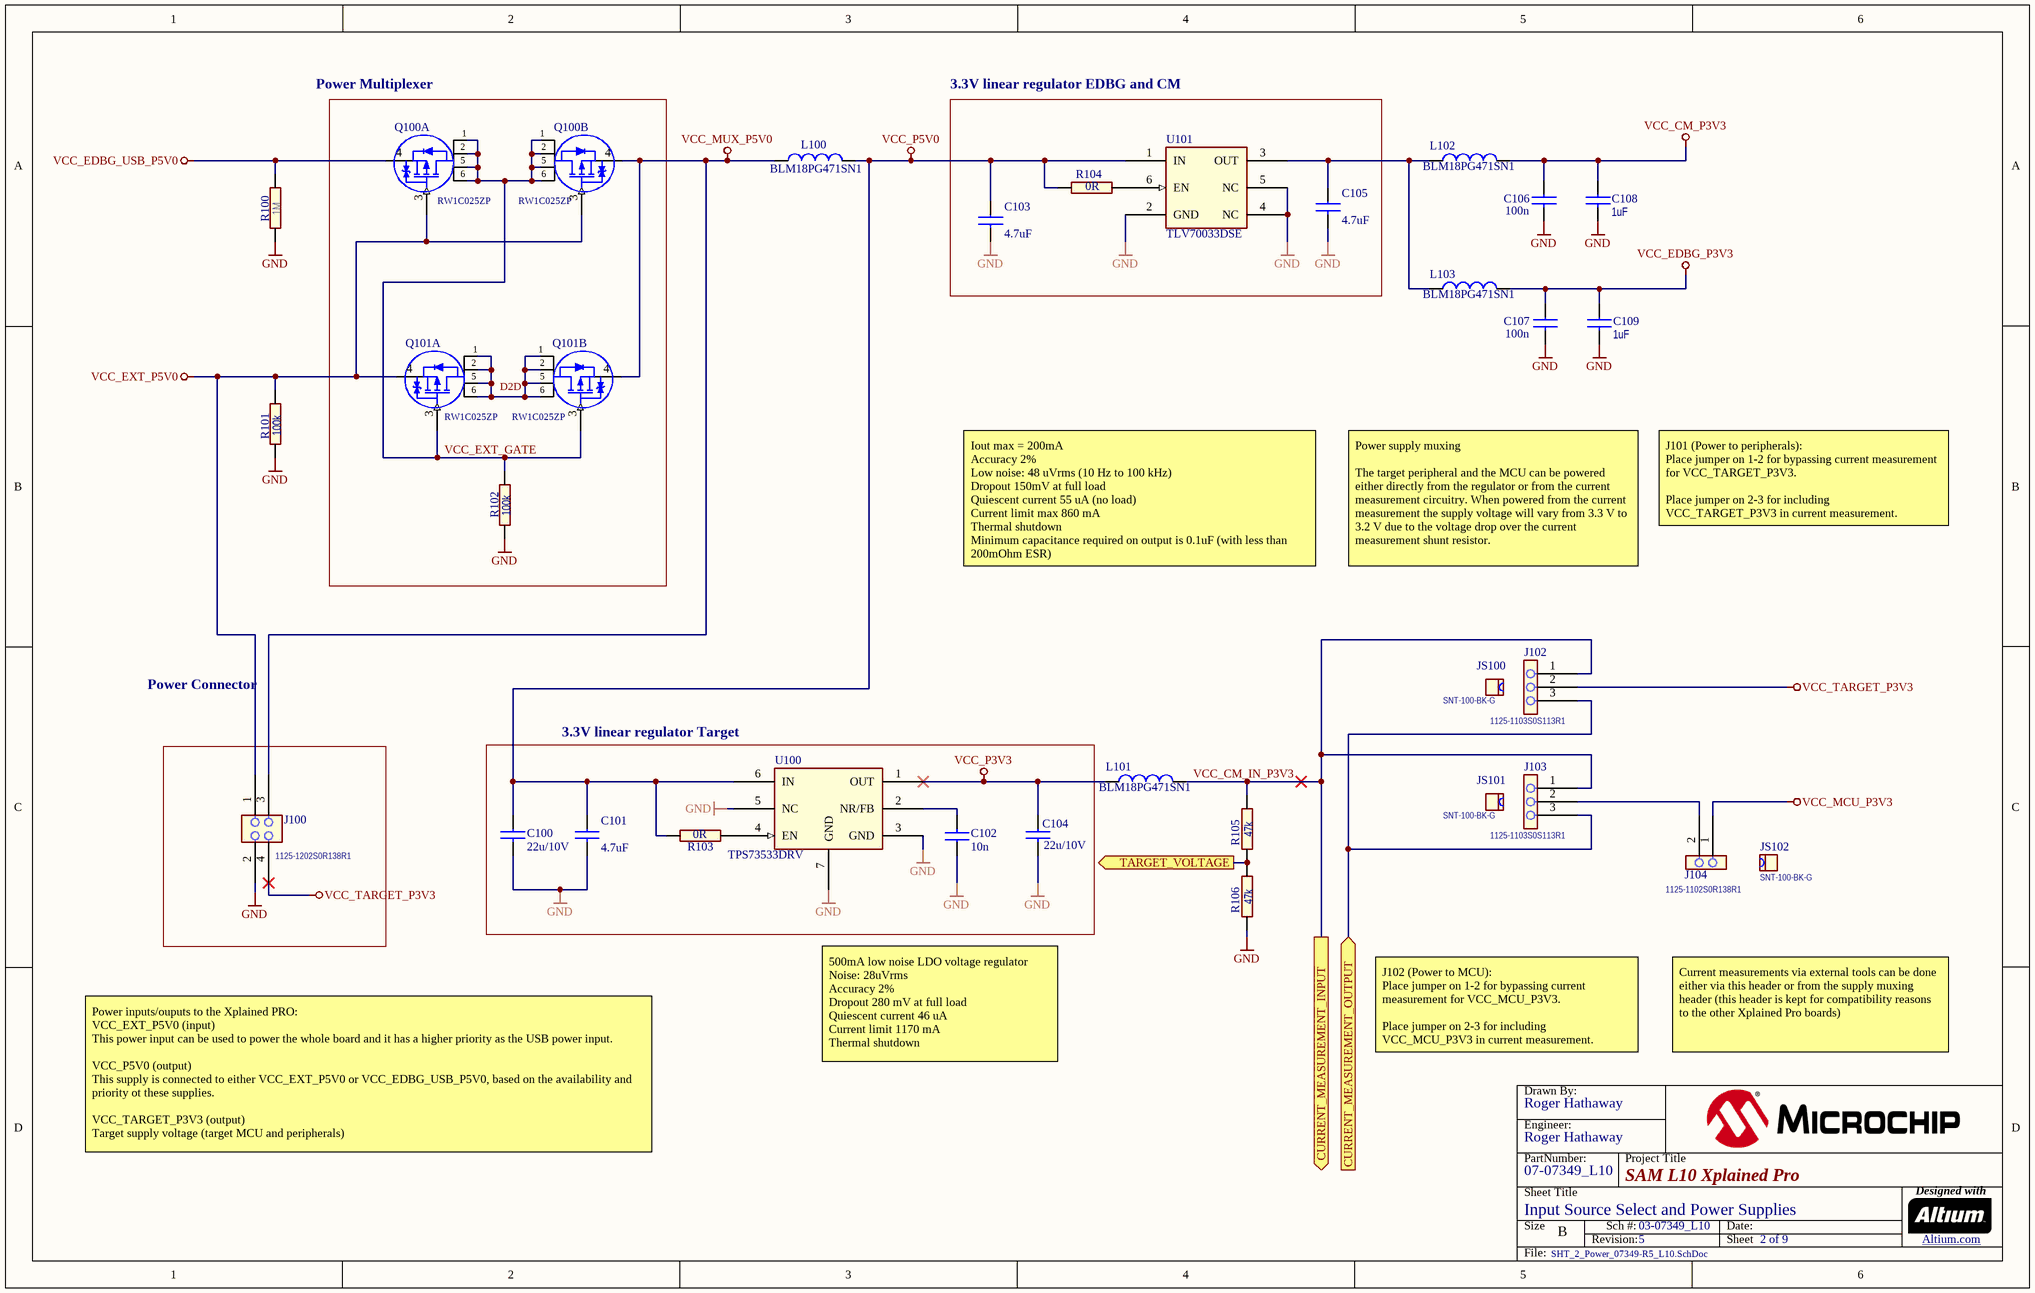
[diagram p7: SHT_2_Power_07349-R5_L10.SchDoc]

### Parts
(Parts that share a designator on the sheet are numbered #1, #2 ... from top to bottom, then left to right.)
?#8  (no value)  (graphical)
C100  value 22u/10V  [AP1-00003]
C101  value 4.7uF  [AP1-00117]
C102  value 10n  [AP1-00053]
C103  value 4.7uF  [AP1-00117]
C104  value 22u/10V  [AP1-00003]
C105  value 4.7uF  [AP1-00117]
C106  value 100n  [AP1-00053]
C107  value 100n  [AP1-00053]
C108  value 1uF  [AP1-00002]  (hidden comment: CAP-NONPOL)
C109  value 1uF  [AP1-00002]  (hidden comment: CAP-NONPOL)
J100  value 1125-1202S0R138R1  [AP8-01076]  (hidden comment: HEADER 2x2)
J102  value 1125-1103S0S113R1  [AP8-01075]  (hidden comment: HEADER 1x3)
J103  value 1125-1103S0S113R1  [AP8-01075]  (hidden comment: HEADER 1x3)
J104  MPN: 1125-1102S0R138R1  [AP8-01071]  (hidden comment: Low cost replacement for A08-0764)
JS100  value SNT-100-BK-G  [AP8-00525]  (hidden comment: To be used by request from ESCATEC)
JS101  value SNT-100-BK-G  [AP8-00525]  (hidden comment: To be used by request from ESCATEC)
JS102  value SNT-100-BK-G  [AP8-00525]  (hidden comment: To be used by request from ESCATEC)
L100  value BLM18PG471SN1  [AP3-00005]
L101  value BLM18PG471SN1  [AP3-00005]
L102  value BLM18PG471SN1  [AP3-00005]
L103  value BLM18PG471SN1  [AP3-00005]
Q100A  Manufacturer Part Number: RW1C025ZP  [AP5-00057]  (hidden comment: MOSFET_RW1C025ZP)
Q100B  Manufacturer Part Number: RW1C025ZP  [AP5-00057]  (hidden comment: MOSFET_RW1C025ZP)
Q101A  Manufacturer Part Number: RW1C025ZP  [AP5-00057]  (hidden comment: MOSFET_RW1C025ZP)
Q101B  Manufacturer Part Number: RW1C025ZP  [AP5-00057]  (hidden comment: MOSFET_RW1C025ZP)
R100  value 1M  [AP2-00011]  (hidden comment: *)
R101  value 100k  [AP2-00011]
R102  value 100k  [AP2-00011]
R103  value 0R  [AP2-00011]
R104  value 0R  [AP2-00011]
R105  value 47k  [AP2-00011]
R106  value 47k  [AP2-00011]
U100  value TPS73533DRV  [AP6-00162]
U101  value TLV70033DSE  [AP6-00262]

### Blocks framed on the sheet
3.3V linear regulator EDBG and CM: C103 C105 R104 U101
3.3V linear regulator Target: C100-C102 C104 R103 U100

### Ports
CURRENT_MEASUREMENT_INPUT (out), CURRENT_MEASUREMENT_OUTPUT (in), TARGET_VOLTAGE (out)

### Nets
GND: C100.2 C101.2 C102.1 C103.2 C104.2 C105.2 C106.2 C107.2 C108.2 C109.2 J100.2 R100.2 R101.1 R102.1 R106.1 U100.3(GND) U100.5(NC) U100.7(GND) U101.2(GND) U101.4(NC) U101.5(NC)
VCC_CM_P3V3: C106.1 C108.1 L102.2
VCC_EDBG_P3V3: C107.1 C109.1 L103.2
VCC_EDBG_USB_P5V0: Q100A.4(S) R100.1
VCC_EXT_P5V0: J100.1 Q100A.3(G) Q100B.3(G) Q101A.4(S) R101.2
VCC_MCU_P3V3: J104.1
VCC_MUX_P5V0: J100.3 L100.1 Q100B.4(S) Q101B.4(S)
VCC_P3V3: C104.1 L101.2 U100.1(OUT)
VCC_P5V0: C100.1 C101.1 C103.1 L100.2 R103.2 R104.2 U100.6(IN) U101.1(IN)
VCC_TARGET_P3V3: J100.4 J102.2
CM_PA09_AIN17: R105.1 R106.2 ; port TARGET_VOLTAGE
CURRENT_MEASUREMENT_OUTPUT: J102.3 J103.3 ; port CURRENT_MEASUREMENT_OUTPUT
VCC_CM_IN_P3V3: J102.1 J103.1 L101.1 R105.2 ; port CURRENT_MEASUREMENT_INPUT
VCC_EXT_GATE: Q100A.1(D) Q100A.2(D) Q100A.5(D) Q100A.6(D) Q100B.1(D) Q100B.2(D) Q100B.5(D) Q100B.6(D) Q101A.3(G) Q101B.3(G) R102.2
NetC102_2: C102.2 U100.2(NR/FB)
NetC105_1: C105.1 L102.1 L103.1 U101.3(OUT)
NetJ103_2: J103.2 J104.2
NetQ101A_1: Q101A.1(D) Q101A.2(D) Q101A.5(D) Q101A.6(D) Q101B.1(D) Q101B.2(D) Q101B.5(D) Q101B.6(D)
NetR103_1: R103.1 U100.4(EN)
NetR104_1: R104.1 U101.6(EN)

### Notes on the sheet
- (near Q100A) Power Multiplexer
- Iout max = 200mA
  Accuracy 2%
  Low noise: 48 uVrms (10 Hz to 100 kHz)
  Dropout 150mV at full load
  Quiescent current 55 uA (no load)
  Current limit max 860 mA
  Thermal shutdown
  Minimum capacitance required on output is 0.1uF (with less than 200mOhm ESR)
- Power supply muxing
  The target peripheral and the MCU can be powered either directly from the regulator or from the current measurement circuitry. When powered from the current measurement the supply voltage will vary from 3.3 V to 3.2 V due to the voltage drop over the current measurement shunt resistor.
- J101 (Power to peripherals):
  Place jumper on 1-2 for bypassing current measurement for VCC_TARGET_P3V3.
  Place jumper on 2-3 for including VCC_TARGET_P3V3 in current measurement.
- Power Connector
- J102 (Power to MCU):
  Place jumper on 1-2 for bypassing current measurement for VCC_MCU_P3V3.
  Place jumper on 2-3 for including VCC_MCU_P3V3 in current measurement.
- Current measurements via external tools can be done either via this header or from the supply muxing header (this header is kept for compatibility reasons to the other Xplained Pro boards)
- 500mA low noise LDO voltage regulator
  Noise: 28uVrms
  Accuracy 2%
  Dropout 280 mV at full load
  Quiescent current 46 uA
  Current limit 1170 mA
  Thermal shutdown
- Power inputs/ouputs to the Xplained PRO:
  VCC_EXT_P5V0 (input)
  This power input can be used to power the whole board and it has a higher priority as the USB power input.
  VCC_P5V0 (output)
  This supply is connected to either VCC_EXT_P5V0 or VCC_EDBG_USB_P5V0, based on the availability and priority ot these supplies.
  VCC_TARGET_P3V3 (output)
  Target supply voltage (target MCU and peripherals)
- Labels drawn without touching a wire or pin: D2D
- Drawn By:
- Engineer:
- PartNumber:
- Project Title
- Sheet Title
- Size
- B
- Revision:
- Sch #:
- Date:
- Sheet
- Designed with
- Altium.com <http://go.altium.com/MicrochipLandingPage_Evaluation.html>
- File:

### Library data of the parts
?#8 = Title Block B
C100 C104 = A01-0500: Ceramic capacitor, SMD 0805, X5R, 10V, Â±20%; PartGroup: Capacitors,Ceramic,SMD 0805; Manufacturer: tdk; MPN: C2012X5R1A226M/0.85; TemperatureRange: -55Â°C to +85Â°C; ComponentStatus: 'Active (verified)'; Status: Active; Verified by: Lars Helge Mo; Verified date: 2005-12-15; AN: A01-0500; Height: 0.949999988079071; FootprintStatus: 'Active (Verified)'
C101 C103 C105 = A01-0377: Ceramic capacitor, SMD 0603, X5R, 10V, 10% (de31036); PartGroup: Capacitors,Ceramic,SMD 0603; Manufacturer: tdk; MPN: C1608X5R1A475K; TemperatureRange: -55 - +85 deg C; ComponentStatus: 'Active (verified)'; Status: Active; Verified by: Lars Helge Mo; Verified date: 2005-12-15; AN: A01-0377; Tolerance: 10%; Height: 0.800000011920929; FootprintStatus: 'Active (Verified)'
C102 = A01-0050: Ceramic capacitor, SMD 0402, X7R, 25V, +/-10%; PartGroup: Capacitors,Ceramic,SMD 0402; Manufacturer: YAGEO CORP; MPN: CC0402KRX7R8BB103; TemperatureRange: -55 - +125 deg C; ComponentStatus: 'Active (verified)'; Status: Active; Verified by: Lars Helge Mo; Verified date: 2005-12-15; AN: A01-0050; Tolerance: 25V, +/-10%; Height: 0,550000011920929; FootprintStatus: 'Active (Verified)'
C106 C107 = A01-0246: as C203 on sheet SHT_3_EDBG_07349-R5_L10; Status: Active; Verified by: Lars Helge Mo; Verified date: 2005-12-15; AN: A01-0246; Tolerance: 16V, +/-10%; Height: 0.5; FootprintStatus: 'Active (Verified)'
C108 C109 = A01-0368: Ceramic capacitor, SMD 0603, X5R, 25V, ±10%; PartGroup: Capacitors,Ceramic,SMD 0603; Manufacturer: Murata; MPN: GRM188R61E105K; ComponentStatus: 'Active (verified)'; Status: Active; Verified by: Lars Helge Mo; Verified date: 2005-12-15; AN: A01-0368; Tolerance: ±10%; Height: 0.800000011920929; FootprintStatus: 'Active (Verified)'
J100 = A08-2784: Pin header, 2x2, Right Angle, 2.54mm, THT, Pin In Paste; PartGroup: Mechanical devices,Connectors,Pin headers; Manufacturer: WCON HARDWARE ELECTRONICS CO., LTD; TemperatureRange: -40Â°C to +105Â°C; ComponentStatus: 'Active (verified)'; Verified date: 2005-12-19; Verified by: Lars Helge Mo; Status: Active; AN: A08-2784; Height: 5.15000009536743; MPN: 1125-1202S0R138R1; FootprintStatus: 'Active (Verified)'
J102 J103 = A08-2783: 1x3 pin header, 2.54mm pitch, Pin-in-Paste THM; PartGroup: Mechanical devices,Connectors,Pin headers; Manufacturer: WCON HARDWARE ELECTRONICS CO., LTD; TemperatureRange: -40Â°C to +105Â°C; ComponentStatus: 'Active (verified)'; Verified date: 2006-01-30; Verified by: Lars Helge Mo; Status: Active; AN: A08-2783; Height: 9; MPN: 1125-1103S0S113R1; FootprintStatus: 'Active (Verified)'
J104 = A08-2775: 1x2 pin header, right angle, 2.54 mm pitch, through-hole; PartGroup: Mechanical devices,Connectors,Pin headers; Manufacturer: WCON HARDWARE ELECTRONICS CO., LTD; Value: Pin header 1x2 right angle; ComponentStatus: 'Active (verified)'; Verified date: 2006-01-30; Verified by: Lars Helge; Status: Active; AN: A08-2775; Height: 2.65000009536743; FootprintStatus: 'Active (Verified)'
JS100-JS102 = A08-0543: Jumper cap for 2.54mm pinheader; PartGroup: Mechanical devices,Mounting accessories,Other; Manufacturer: SAMTEC; ComponentStatus: 'Active (verified)'; Verified date: 2006-04-05; Verified by: Lars Helge Mo; Status: Active; AN: A08-0543; MPN: SNT-100-BK-G; FootprintStatus: 'Active (Verified)'
L100-L103 = A03-0035: as L200 on sheet SHT_3_EDBG_07349-R5_L10; Verified date: 2006-01-30; Verified by: Lars Helge Mo; Status: Active; AN: A03-0035; Height: 0.800000011920929; MPN: BLM18PG471SN1; FootprintStatus: 'Active (Verified)'
Q100A Q100B Q101A Q101B = A05-0181: Pch -20V -2.5A Small Signal MOSFET; Manufacturer: ROHM; PartGroup: Transistors,Power FET,SMD; FET Type: MOSFET P-Channel; Drain to Source Voltage (Vdss): 20V; Rds On (Max) @ Id, Vgs: 65 mOhm @ -2.5A, - 4.5V; Vgs(th) (Max) @ Id: -1V @ -1mA; Power - Max: 700mW; TemperatureRange: -55 to +150; ComponentStatus: 'Active (verified)'; RoHS: RoHS Compliant; Mounting Type: Surface Mount; Package / Case: SOT-563T; MPN: RW1C025ZP; AN: A05-0181; Value: RW1C025ZP; Height: 0.649999976158142; FootprintStatus: 'Active (Verified)'
R100 = A02-0846: as R200 on sheet SHT_3_EDBG_07349-R5_L10; Status: Active; Verified by: Lars Helge Mo; Verified date: 2005-12-19; AN: A02-0846; Tolerance: 1%; Height: 0.349999994039536; FootprintStatus: 'Active (Verified)'
R101 R102 = A02-0260: Thick film resistor, SMD 0402, 1/16W, 1%; PartGroup: Resistors,SMD,0402 1%; Manufacturer: ASJ; MPN: CR10-1003-FK; TemperatureRange: -55ï¿½ to +125ï¿½C; ComponentStatus: 'Active (verified)'; Status: Active; Verified by: Lars Helge Mo; Verified date: 2005-12-19; AN: A02-0260; Tolerance: 1 %; Height: 0.349999994039536; FootprintStatus: 'Active (Verified)'
R103 R104 = A02-0163: as R201-R209 on sheet SHT_3_EDBG_07349-R5_L10; Status: Active; Verified by: Lars Helge Mo; Verified date: 2005-12-19; AN: A02-0163; Height: 0.349999994039536; FootprintStatus: 'Active (Verified)'
R105 R106 = A02-0252: Thick film resistor, SMD 0402, 1/16W, 1%; PartGroup: Resistors,SMD,0402 1%; Manufacturer: KOA; MPN: RK73H1ETTP4702F; TemperatureRange: -55 - +125 deg C; ComponentStatus: 'Active (verified)'; Placement: YES; Status: Active; Verified by: Lars Helge Mo; Verified date: 2005-12-19; AN: A02-0252; Tolerance: 1 %; Height: 0.349999994039536; FootprintStatus: 'Active (Verified)'
U100 = A06-1135: Low noise LDO, 500 mA, Vout=3.3V, 2% accuracy, IQ=46uA, noise=28uVrms, VIN= 2.7V to 6.5V, Vdo=280mV,stable with low ESR capacitor; PartGroup: Integrated Circuits,Regulators,Linear; Manufacturer: Texas Instruments; ComponentStatus: 'Active (verified)'; AN: A06-1135; Height: 0.75; MPN: TPS73533DRV; FootprintStatus: 'Active (Verified)'
U101 = A06-0719: LDO, 200 mA, Iq=31 uA, Vdo=250mV, Vout=3.3V, VIN= 2 V to 5.5V, SON-6 package; PartGroup: Integrated Circuits,Regulators,Linear; Manufacturer: Texas Instruments; ComponentStatus: 'Active (verified)'; AN: A06-0719; Height: 0.800000011920929; MPN: TLV70033DSE; FootprintStatus: 'Active (Verified)'